# Altium project TVC_FC.PrjPcb
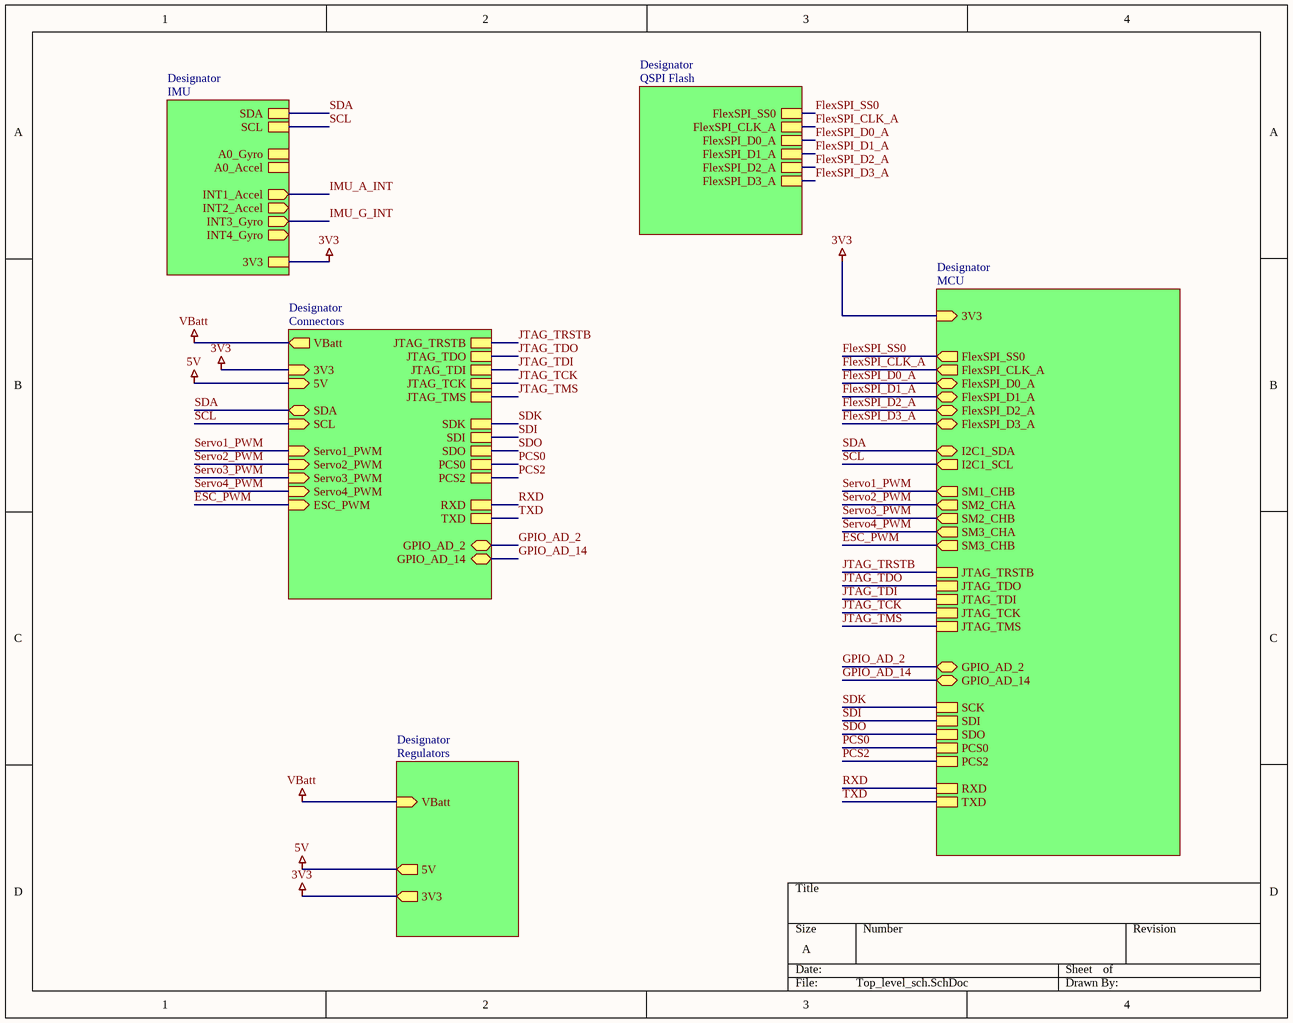
[diagram p0: Top_level_sch.SchDoc]
6 sheets, 92 parts. Net scope: hierarchical (ports join the sheet entries above them; power ports are global).
Board file: FC_PCB.PcbDoc
Sheets:
  Top_level_sch.SchDoc
    Designator = MCU.SchDoc
    Designator = IMU.SchDoc
    Designator = Connectors.SchDoc
    Designator = Regulators.SchDoc
    Designator = QSPI Flash.SchDoc

## Sheet Top_level_sch.SchDoc
size A; SheetNumber: 1; SheetTotal: 6

### Sub-sheets
Designator = MCU: I2C1_SCL (out), I2C1_SDA (bidir), JTAG_TRSTB, JTAG_TDO, JTAG_TDI, JTAG_TCK, JTAG_TMS, 3V3 (in), SM2_CHA (out), SM2_CHB (out), SM1_CHB (out), SM3_CHB (out), SM3_CHA (out), GPIO_AD_2 (bidir), GPIO_AD_14 (bidir), SCK, SDI, SDO, PCS0, PCS2, RXD, TXD, FlexSPI_SS0 (out), FlexSPI_D1_A (bidir), FlexSPI_D2_A (bidir), FlexSPI_D0_A (bidir), FlexSPI_CLK_A (out), FlexSPI_D3_A (bidir)
Designator = IMU: SCL, INT1_Accel (out), INT3_Gyro (out), SDA, INT4_Gyro (out), INT2_Accel (out), A0_Accel, A0_Gyro, 3V3
Designator = Connectors: SDA (bidir), SCL (in), 5V (in), 3V3 (in), Servo1_PWM (in), ESC_PWM (in), VBatt (out), Servo2_PWM (in), Servo3_PWM (in), Servo4_PWM (in), JTAG_TRSTB, JTAG_TDO, JTAG_TDI, JTAG_TCK, JTAG_TMS, SDK, SDI, SDO, PCS0, PCS2, RXD, TXD, GPIO_AD_2 (bidir), GPIO_AD_14 (bidir)
Designator = Regulators: VBatt (in), 5V (out), 3V3 (out)
Designator = QSPI Flash: FlexSPI_D0_A, FlexSPI_CLK_A, FlexSPI_SS0, FlexSPI_D2_A, FlexSPI_D3_A, FlexSPI_D1_A

### Nets
3V3: sheet Designator/3V3, sheet Designator/3V3, sheet Designator/3V3, sheet Designator/3V3
5V: sheet Designator/5V, sheet Designator/5V
VBatt: sheet Designator/VBatt, sheet Designator/VBatt  [project net FB]
ESC_PWM: sheet Designator/SM3_CHB, sheet Designator/ESC_PWM
FlexSPI_CLK_A: sheet Designator/FlexSPI_CLK_A, sheet Designator/FlexSPI_CLK_A
FlexSPI_D0_A: sheet Designator/FlexSPI_D0_A, sheet Designator/FlexSPI_D0_A
FlexSPI_D1_A: sheet Designator/FlexSPI_D1_A, sheet Designator/FlexSPI_D1_A
FlexSPI_D2_A: sheet Designator/FlexSPI_D2_A, sheet Designator/FlexSPI_D2_A
FlexSPI_D3_A: sheet Designator/FlexSPI_D3_A, sheet Designator/FlexSPI_D3_A
FlexSPI_SS0: sheet Designator/FlexSPI_SS0, sheet Designator/FlexSPI_SS0
GPIO_AD_2: sheet Designator/GPIO_AD_2, sheet Designator/GPIO_AD_2
GPIO_AD_14: sheet Designator/GPIO_AD_14, sheet Designator/GPIO_AD_14
JTAG_TCK: sheet Designator/JTAG_TCK, sheet Designator/JTAG_TCK
JTAG_TDI: sheet Designator/JTAG_TDI, sheet Designator/JTAG_TDI
JTAG_TDO: sheet Designator/JTAG_TDO, sheet Designator/JTAG_TDO
JTAG_TMS: sheet Designator/JTAG_TMS, sheet Designator/JTAG_TMS
JTAG_TRSTB: sheet Designator/JTAG_TRSTB, sheet Designator/JTAG_TRSTB
PCS0: sheet Designator/PCS0, sheet Designator/PCS0
PCS2: sheet Designator/PCS2, sheet Designator/PCS2
RXD: sheet Designator/RXD, sheet Designator/RXD
SCL: sheet Designator/I2C1_SCL, sheet Designator/SCL, sheet Designator/SCL
SDA: sheet Designator/I2C1_SDA, sheet Designator/SDA, sheet Designator/SDA
SDI: sheet Designator/SDI, sheet Designator/SDI
SDK: sheet Designator/SCK, sheet Designator/SDK
SDO: sheet Designator/SDO, sheet Designator/SDO
Servo1_PWM: sheet Designator/SM1_CHB, sheet Designator/Servo1_PWM
Servo2_PWM: sheet Designator/SM2_CHA, sheet Designator/Servo2_PWM
Servo3_PWM: sheet Designator/SM2_CHB, sheet Designator/Servo3_PWM
Servo4_PWM: sheet Designator/SM3_CHA, sheet Designator/Servo4_PWM
TXD: sheet Designator/TXD, sheet Designator/TXD

## Sheet MCU.SchDoc
size C; SheetNumber: 2; SheetTotal: 6
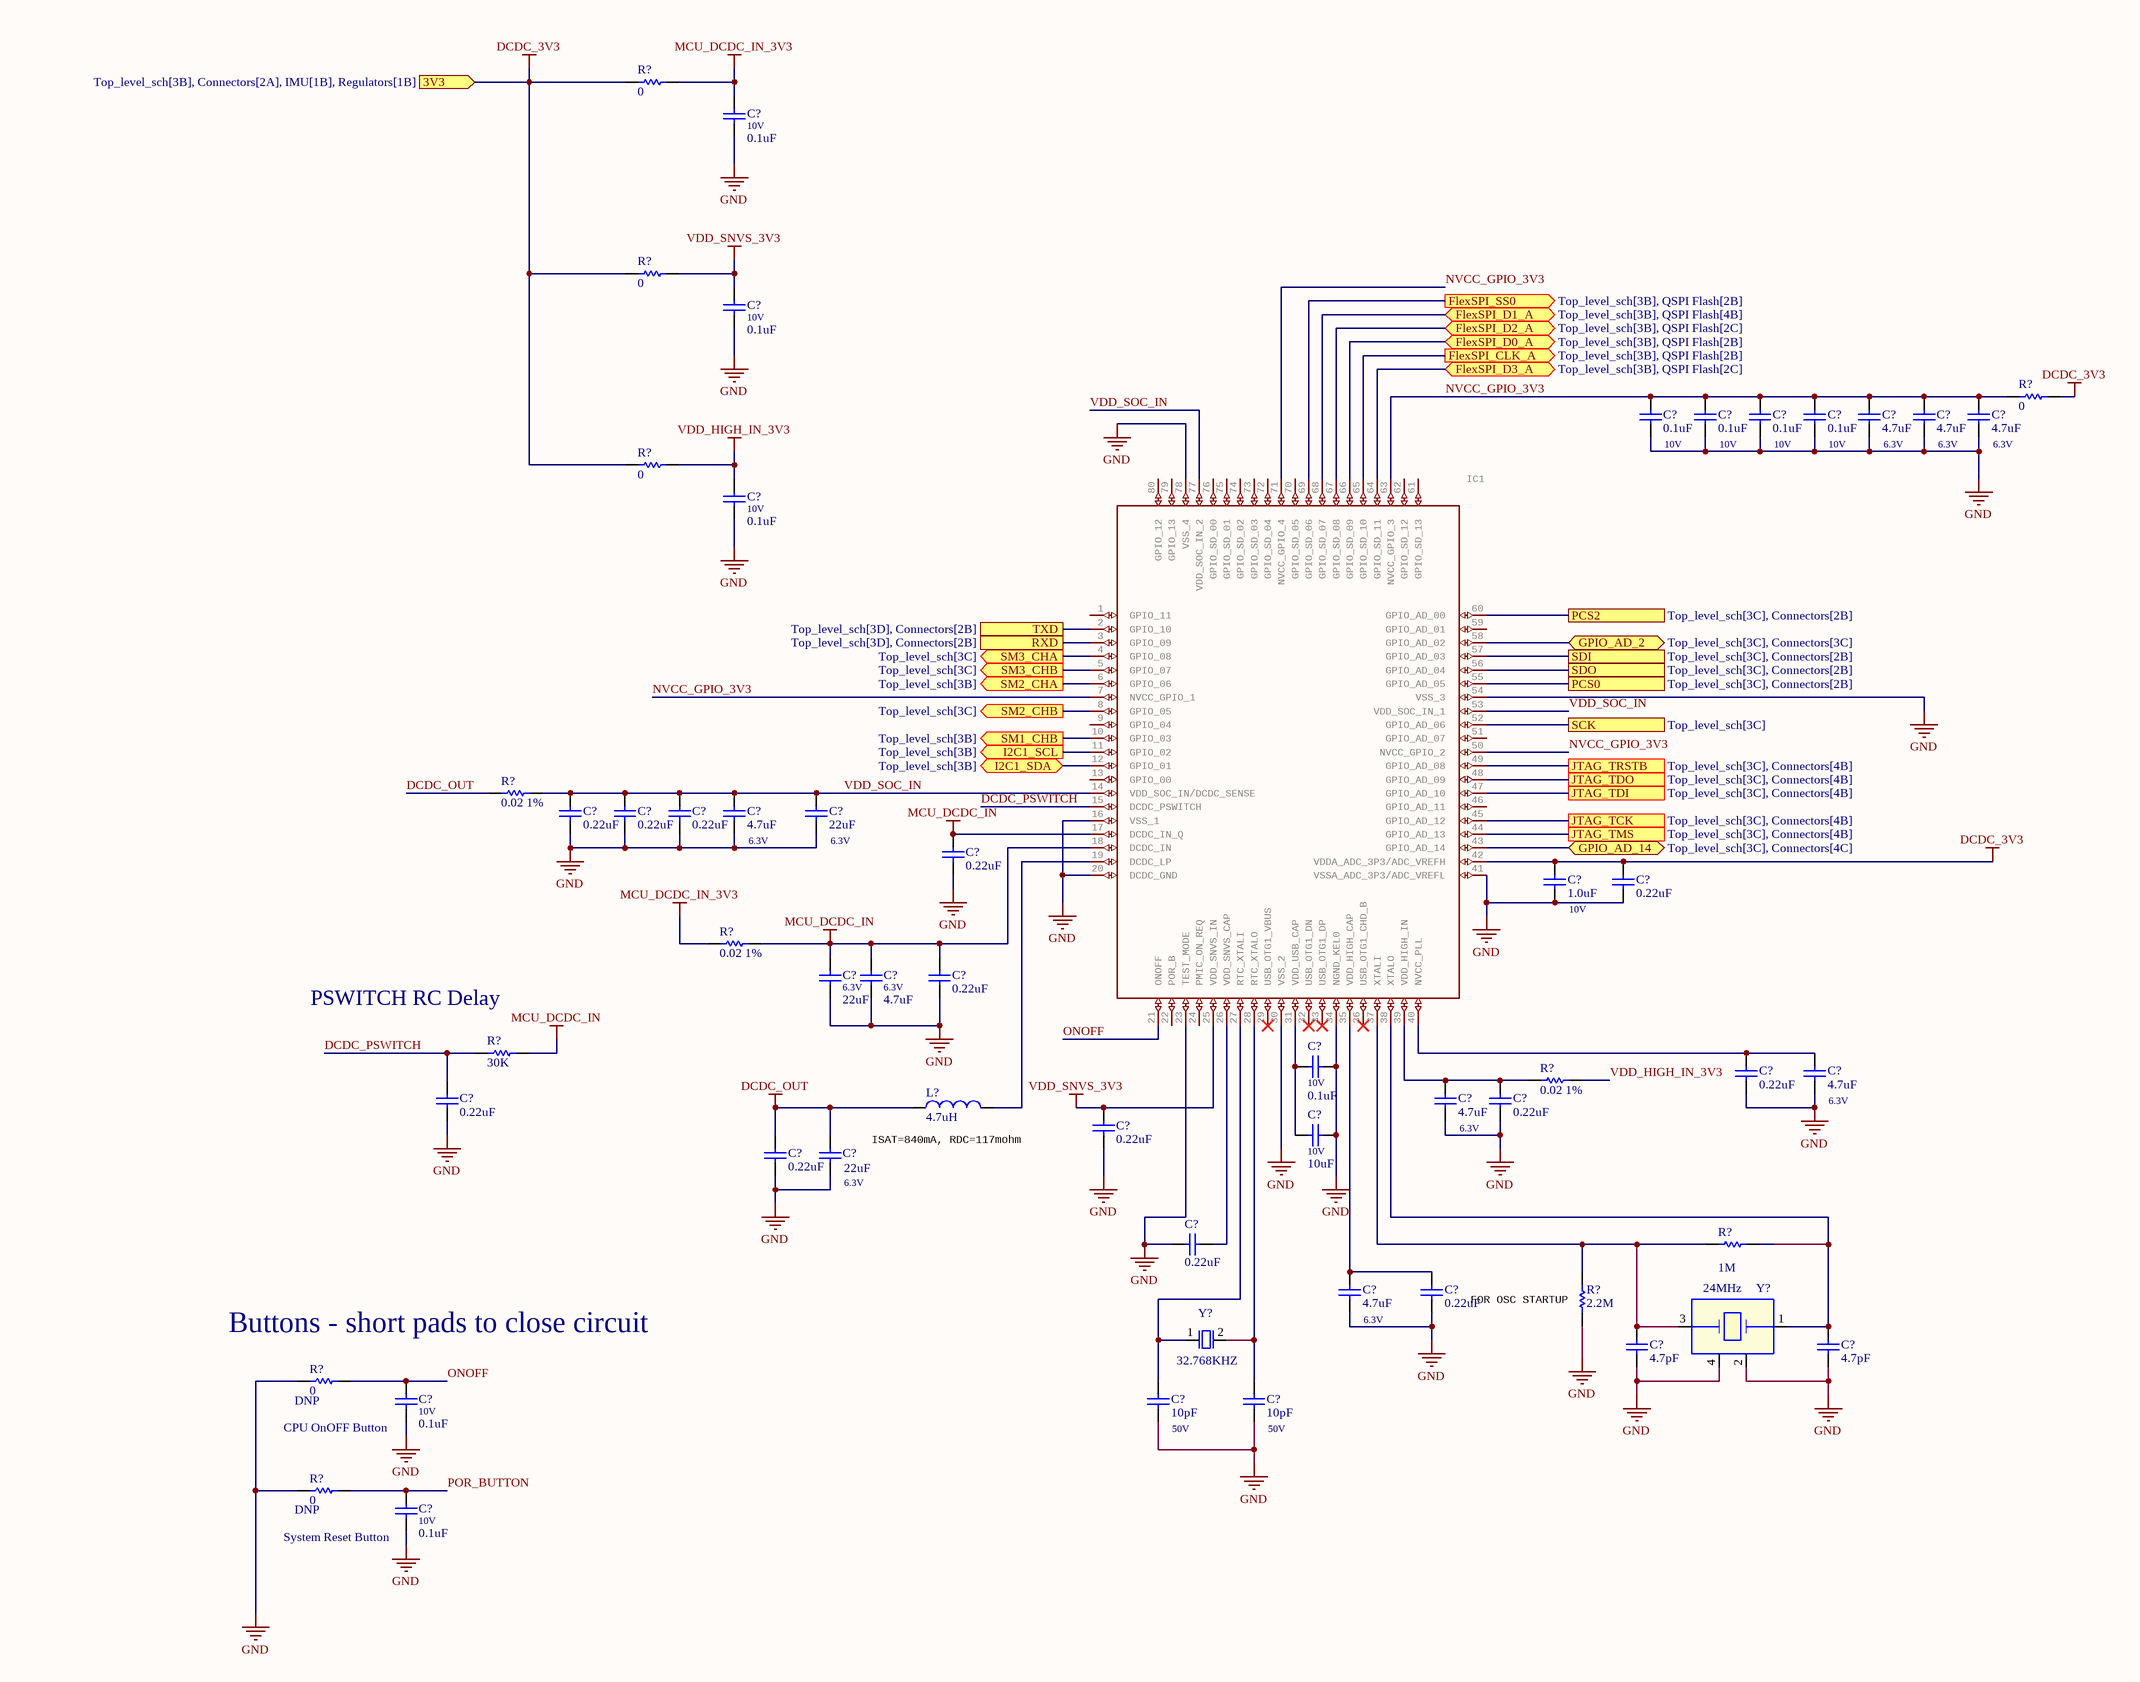
[diagram p1: MCU.SchDoc]

### Parts
(Parts that share a designator on the sheet are numbered #1, #2 ... from top to bottom, then left to right.)
C?#1  value 0.1uF  Voltage: 10V  (hidden comment: Capacitor)
C?#2  value 0.1uF  Voltage: 10V  (hidden comment: Capacitor)
C?#3  value 0.1uF  Voltage: 10V  (hidden comment: Capacitor)
C?#4  value 0.1uF  Voltage: 10V  (hidden comment: Capacitor)
C?#5  value 0.1uF  Voltage: 10V  (hidden comment: Capacitor)
C?#6  value 0.1uF  Voltage: 10V  (hidden comment: Capacitor)
C?#7  value 4.7uF  Voltage: 6.3V  (hidden comment: Capacitor)
C?#8  value 4.7uF  Voltage: 6.3V  (hidden comment: Capacitor)
C?#9  value 4.7uF  Voltage: 6.3V  (hidden comment: Capacitor)
C?#10  value 0.1uF  Voltage: 10V  (hidden comment: Capacitor)
C?#11  OC14: 0.22uF  (hidden comment: Capacitor)
C?#12  OC15: 0.22uF  (hidden comment: Capacitor)
C?#13  OC16: 0.22uF  (hidden comment: Capacitor)
C?#14  value 4.7uF  Voltage: 6.3V  (hidden comment: Capacitor)
C?#15  value 22uF  Voltage: 6.3V  (hidden comment: Capacitor)
C?#16  value 0.22uF  (hidden comment: Capacitor)
C?#17  value 1.0uF  Voltage: 10V  (hidden comment: Capacitor)
C?#18  OC7: 0.22uF  (hidden comment: Capacitor)
C?#19  value 22uF  Voltage: 6.3V  (hidden comment: Capacitor)
C?#20  value 4.7uF  Voltage: 6.3V  (hidden comment: Capacitor)
C?#21  value 0.22uF  (hidden comment: Capacitor)
C?#22  value 0.1uF  Voltage: 10V  (hidden comment: Capacitor)
C?#23  OC25: 0.22uF  (hidden comment: Capacitor)
C?#24  value 4.7uF  Voltage: 6.3V  (hidden comment: Capacitor)
C?#25  value 0.22uF  (hidden comment: Capacitor)
C?#26  value 4.7uF  Voltage: 6.3V  (hidden comment: Capacitor)
C?#27  OC20: 0.22uF  (hidden comment: Capacitor)
C?#28  value 10uF  Voltage: 10V  (hidden comment: Capacitor)
C?#29  value 0.22uF  (hidden comment: Capacitor)
C?#30  value 0.22uF  (hidden comment: Capacitor)
C?#31  value 22uF  Voltage: 6.3V  (hidden comment: Capacitor)
C?#32  OC24: 0.22uF  (hidden comment: Capacitor)
C?#33  value 4.7uF  Voltage: 6.3V  (hidden comment: Capacitor)
C?#34  OC22: 0.22uF  (hidden comment: Capacitor)
C?#35  OC16: 4.7pF  (hidden comment: Capacitor)
C?#36  OC16: 4.7pF  (hidden comment: Capacitor)
C?#37  value 0.1uF  Voltage: 10V  (hidden comment: Capacitor)
C?#38  value 10pF  Voltage: 50V  (hidden comment: Capacitor)
C?#39  value 10pF  Voltage: 50V  (hidden comment: Capacitor)
C?#40  value 0.1uF  Voltage: 10V  (hidden comment: Capacitor)
IC1  ARM Microcontrollers - MCU i.MX RT1010 Crossover MCU with Arm  Cortex -M7 core   Source:  Datasheet  [QFP50P1400X1400X160-80N]  (value not drawn)
L?#1  value 4.7uH  (hidden comment: Inductor)
R?#1  value 0  (hidden comment: Resistor)
R?#2  value 0  (hidden comment: Resistor)
R?#3  OR12: 0  (hidden comment: Resistor)
R?#4  value 0  (hidden comment: Resistor)
R?#5  OR13: 0.02 1%  (hidden comment: Resistor)
R?#6  value 0.02 1%  (hidden comment: Resistor)
R?#7  value 30K  (hidden comment: Resistor)
R?#8  OR14: 0.02 1%  (hidden comment: Resistor)
R?#9  value 1M  (hidden comment: Resistor)
R?#10  OR13: 2.2M  (hidden comment: Resistor)
R?#11  value 0  (hidden comment: Resistor)
R?#12  value 0  (hidden comment: Resistor)
Y?#1  24MHz  [xtl4_2p1x1p7mm_sm]
Y?#2  32.768KHZ  [XTAL2-3p2x1p5-SM]

### Ports
3V3 (in, see Top_level_sch[3B], Connectors[2A], IMU[1B], Regulators[1B]), FlexSPI_CLK_A (out, see Top_level_sch[3B], QSPI Flash[2B]), FlexSPI_D0_A (bidir, see Top_level_sch[3B], QSPI Flash[2B]), FlexSPI_D1_A (bidir, see Top_level_sch[3B], QSPI Flash[4B]), FlexSPI_D2_A (bidir, see Top_level_sch[3B], QSPI Flash[2C]), FlexSPI_D3_A (bidir, see Top_level_sch[3B], QSPI Flash[2C]), FlexSPI_SS0 (out, see Top_level_sch[3B], QSPI Flash[2B]), GPIO_AD_2 (bidir, see Top_level_sch[3C], Connectors[3C]), GPIO_AD_14 (bidir, see Top_level_sch[3C], Connectors[4C]), I2C1_SCL (out, see Top_level_sch[3B]), I2C1_SDA (bidir, see Top_level_sch[3B]), JTAG_TCK (see Top_level_sch[3C], Connectors[4B]), JTAG_TDI (see Top_level_sch[3C], Connectors[4B]), JTAG_TDO (see Top_level_sch[3C], Connectors[4B]), JTAG_TMS (see Top_level_sch[3C], Connectors[4B]), JTAG_TRSTB (see Top_level_sch[3C], Connectors[4B]), PCS0 (see Top_level_sch[3C], Connectors[2B]), PCS2 (see Top_level_sch[3C], Connectors[2B]), RXD (see Top_level_sch[3D], Connectors[2B]), SCK (see Top_level_sch[3C]), SDI (see Top_level_sch[3C], Connectors[2B]), SDO (see Top_level_sch[3C], Connectors[2B]), SM1_CHB (out, see Top_level_sch[3B]), SM2_CHA (out, see Top_level_sch[3B]), SM2_CHB (out, see Top_level_sch[3C]), SM3_CHA (out, see Top_level_sch[3C]), SM3_CHB (out, see Top_level_sch[3C]), TXD (see Top_level_sch[3D], Connectors[2B])

### Nets
DCDC_3V3: C?#17.2 C?#18.2 IC1.42(VDDA_ADC_3P3/ADC_VREFH) R?#1.1 R?#2.1 R?#3.2 R?#4.1 ; port 3V3  [project net 3V3]
DCDC_OUT: C?#30.2 C?#31.2 L?#1.1 R?#5.1
GND: C?#1.2 C?#2.2 C?#3.1 C?#4.1 C?#5.1 C?#6.1 C?#7.1 C?#8.1 C?#9.1 C?#10.2 C?#11.1 C?#12.1 C?#13.1 C?#14.1 C?#15.1 C?#16.1 C?#17.1 C?#18.1 C?#19.1 C?#20.1 C?#21.1 C?#22.1 C?#23.1 C?#24.1 C?#25.1 C?#26.1 C?#27.1 C?#28.1 C?#29.1 C?#30.1 C?#31.1 C?#32.2 C?#33.1 C?#34.1 C?#35.1 C?#36.1 C?#37.2 C?#38.1 C?#39.1 C?#40.2 IC1.16(VSS_1) IC1.20(DCDC_GND) IC1.23(TEST_MODE) IC1.30(VSS_2) IC1.34(NGND_KEL0) IC1.41(VSSA_ADC_3P3/ADC_VREFL) IC1.54(VSS_3) IC1.78(VSS_4) R?#10.1 R?#11.1 R?#12.1 Y?#1.2 Y?#1.4  [project net FB]
MCU_DCDC_IN: C?#16.2 C?#19.2 C?#20.2 C?#21.2 IC1.17(DCDC_IN_Q) IC1.18(DCDC_IN) R?#6.1 R?#7.1
MCU_DCDC_IN_3V3: C?#1.1 R?#1.2 R?#6.2
VDD_HIGH_IN_3V3: C?#10.1 R?#4.2 R?#8.2
VDD_SNVS_3V3: C?#2.1 C?#29.2 IC1.25(VDD_SNVS_IN) R?#2.2
DCDC_PSWITCH: C?#25.2 IC1.15(DCDC_PSWITCH) R?#7.2
ESC_PWM: IC1.5(GPIO_07) ; port SM3_CHB
FlexSPI_CLK_A: IC1.65(GPIO_SD_10) ; port FlexSPI_CLK_A
FlexSPI_D0_A: IC1.66(GPIO_SD_09) ; port FlexSPI_D0_A
FlexSPI_D1_A: IC1.68(GPIO_SD_07) ; port FlexSPI_D1_A
FlexSPI_D2_A: IC1.67(GPIO_SD_08) ; port FlexSPI_D2_A
FlexSPI_D3_A: IC1.64(GPIO_SD_11) ; port FlexSPI_D3_A
FlexSPI_SS0: IC1.69(GPIO_SD_06) ; port FlexSPI_SS0
GPIO_AD_2: IC1.58(GPIO_AD_02) ; port GPIO_AD_2
GPIO_AD_14: IC1.43(GPIO_AD_14) ; port GPIO_AD_14
JTAG_TCK: IC1.45(GPIO_AD_12) ; port JTAG_TCK
JTAG_TDI: IC1.47(GPIO_AD_10) ; port JTAG_TDI
JTAG_TDO: IC1.48(GPIO_AD_09) ; port JTAG_TDO
JTAG_TMS: IC1.44(GPIO_AD_13) ; port JTAG_TMS
JTAG_TRSTB: IC1.49(GPIO_AD_08) ; port JTAG_TRSTB
NVCC_GPIO_3V3: C?#3.2 C?#4.2 C?#5.2 C?#6.2 C?#7.2 C?#8.2 C?#9.2 IC1.7(NVCC_GPIO_1) IC1.50(NVCC_GPIO_2) IC1.63(NVCC_GPIO_3) IC1.71(NVCC_GPIO_4) R?#3.1
ONOFF: C?#37.1 IC1.21(ONOFF) R?#11.2
PCS0: IC1.55(GPIO_AD_05) ; port PCS0
PCS2: IC1.60(GPIO_AD_00) ; port PCS2
POR_BUTTON: C?#40.1 R?#12.2
RXD: IC1.3(GPIO_09) ; port RXD
SCL: IC1.11(GPIO_02) ; port I2C1_SCL
SDA: IC1.12(GPIO_01) ; port I2C1_SDA
SDI: IC1.57(GPIO_AD_03) ; port SDI
SDK: IC1.52(GPIO_AD_06) ; port SCK
SDO: IC1.56(GPIO_AD_04) ; port SDO
Servo1_PWM: IC1.10(GPIO_03) ; port SM1_CHB
Servo2_PWM: IC1.6(GPIO_06) ; port SM2_CHA
Servo3_PWM: IC1.8(GPIO_05) ; port SM2_CHB
Servo4_PWM: IC1.4(GPIO_08) ; port SM3_CHA
TXD: IC1.2(GPIO_10) ; port TXD
VDD_SOC_IN: C?#11.2 C?#12.2 C?#13.2 C?#14.2 C?#15.2 IC1.14(VDD_SOC_IN/DCDC_SENSE) IC1.53(VDD_SOC_IN_1) IC1.77(VDD_SOC_IN_2) R?#5.2
NetC?#22_2: C?#22.2 C?#28.2 IC1.31(VDD_USB_CAP)
NetC?#23_2: C?#23.2 C?#24.2 IC1.40(NVCC_PLL)
NetC?#26_2: C?#26.2 C?#27.2 IC1.39(VDD_HIGH_IN) R?#8.1
NetC?#32_1: C?#32.1 IC1.26(VDD_SNVS_CAP)
NetC?#33_2: C?#33.2 C?#34.2 IC1.35(VDD_HIGH_CAP)
NetC?#35_2: C?#35.2 IC1.37(XTALI) R?#9.1 R?#10.2 Y?#1.3
NetC?#36_2: C?#36.2 IC1.38(XTALO) R?#9.2 Y?#1.1
NetC?#38_2: C?#38.2 IC1.27(RTC_XTALI) Y?#2.1
NetC?#39_2: C?#39.2 IC1.28(RTC_XTALO) Y?#2.2
NetIC1_19: IC1.19(DCDC_LP) L?#1.2

Not connected (* = marked no-connect by the designer): IC1 1(GPIO_11) 9(GPIO_04) 13(GPIO_00) 22(POR_B) 24(PMIC_ON_REQ) 29(USB_OTG1_VBUS)* 32(USB_OTG1_DN)* 33(USB_OTG1_DP)* 36(USB_OTG1_CHD_B)* 46(GPIO_AD_11) 51(GPIO_AD_07) 59(GPIO_AD_01) 61(GPIO_SD_13) 62(GPIO_SD_12) 70(GPIO_SD_05) 72(GPIO_SD_04) 73(GPIO_SD_03) 74(GPIO_SD_02) 75(GPIO_SD_01) 76(GPIO_SD_00) 79(GPIO_13) 80(GPIO_12)

### Notes on the sheet
- (near R?#7) PSWITCH RC Delay
- ISAT=840mA, RDC=117mohm
- Buttons - short pads to close circuit
- FOR OSC STARTUP
- CPU OnOFF Button
- (near C?#40) System Reset Button

### Library data of the parts
C?#1-C?#40 = Capacitor: SimulationGenericComponent: True
IC1 = MIMXRT1011DAE5A: Manufacturer_Name: NXP; GateName_1: G$1; SymbolName_1: MIMXRT1011DAE5A; LibraryName: MIMXRT1011DAE5A; DeviceSetName: MIMXRT1011DAE5A; Package: QFP50P1400X1400X160-80N; Manufacturer_Part_Number: MIMXRT1011DAE5A; Mouser_Part_Number: 771-MIMXRT1011DAE5A; Mouser_Price-Stock: https://www.mouser.co.uk/ProductDetail/NXP-Semiconductors/MIMXRT1011DAE5A?qs=P1JMDcb91o5GoeF%252BJrcvqQ%3D%3D; Arrow_Part_Number: MIMXRT1011DAE5A; Arrow_Price-Stock: https://www.arrow.com/en/products/mimxrt1011dae5a/nxp-semiconductors; Height: 1.6mm
L?#1 = Inductor: SimulationGenericComponent: True
R?#1-R?#4 R?#11 R?#12 = Resistor: SimulationGenericComponent: True; TC1: 0; TC2: 0
R?#5-R?#10 = Resistor: TC1: 0; SimulationGenericComponent: True; TC2: 0
Y?#1 = XTAL_13: XTAL 24MHZ -- 20PPM 2.0X1.6MM SMD; CLASS: IC; CAD_APPROVED: Yes; Temp_Range: -30C to 85C; MFG_PN01: XRCGB24M000F2P29R0; MFG_NAME01: MURATA; AGILE_PN: 230-78216; PCB Footprint: xtl4_2p1x1p7mm_sm; HEIGHT: 0.7MM; ROHS: Yes
Y?#2 = CRYSTAL: XTAL 32.768KHZ 7PF 20PPM -- SMT; CLASS: IC; AGILE_PN: 230-78102; MFG_NAME01: EPSON ELECTRONICS; MFG_PN01: FC-135 32.7680KA-AG3; CAD_APPROVED: Yes; PCB Footprint: XTAL2-3p2x1p5-SM; ROHS: Yes; HEIGHT: 0.9MM

## Sheet IMU.SchDoc
size A; SheetNumber: 3; SheetTotal: 6
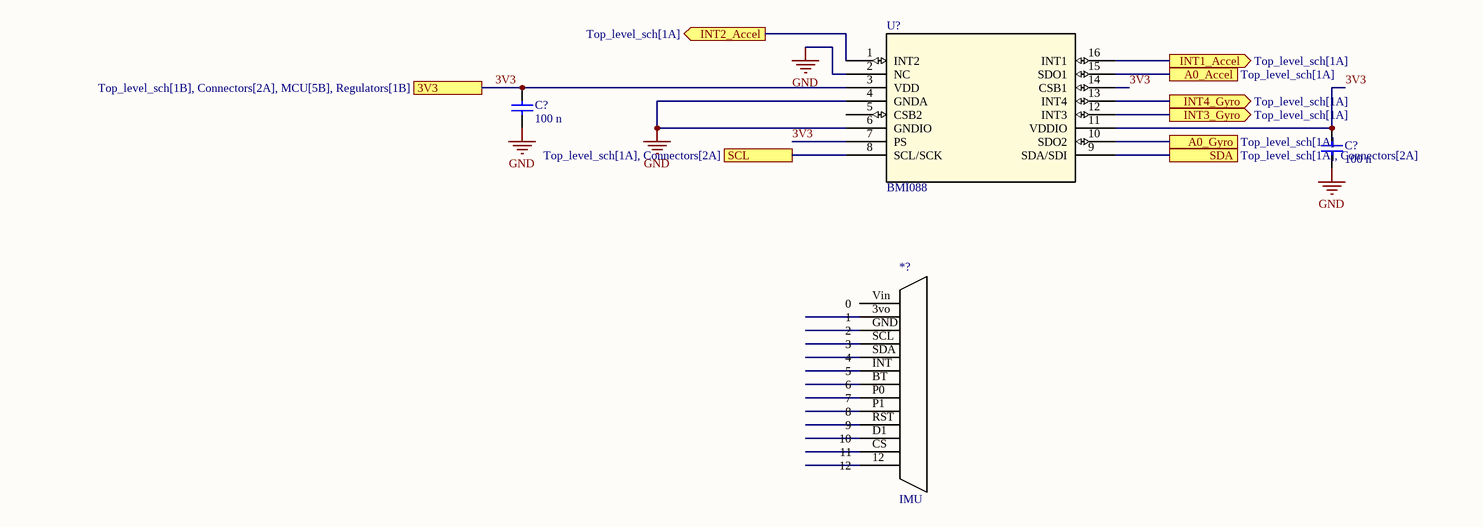
[diagram p2: IMU.SchDoc]

### Parts
(Parts that share a designator on the sheet are numbered #1, #2 ... from top to bottom, then left to right.)
*?  IMU
C?#41  value 100 n  (hidden comment: Capacitor)
C?#42  value 100 n  (hidden comment: Capacitor)
U?#1  BMI088  [QFN_BMI085_BOS]

### Ports
3V3 (see Top_level_sch[1B], Connectors[2A], MCU[5B], Regulators[1B]), A0_Accel (see Top_level_sch[1A]), A0_Gyro (see Top_level_sch[1A]), INT1_Accel (out, see Top_level_sch[1A]), INT2_Accel (out, see Top_level_sch[1A]), INT3_Gyro (out, see Top_level_sch[1A]), INT4_Gyro (out, see Top_level_sch[1A]), SCL (see Top_level_sch[1A], Connectors[2A]), SDA (see Top_level_sch[1A], Connectors[2A])

### Nets
3V3: C?#41.1 C?#42.1 U?#1.3(VDD) U?#1.7(PS) U?#1.11(VDDIO) U?#1.14(CSB1) ; port 3V3
GND: C?#41.2 C?#42.2 U?#1.2(NC) U?#1.4(GNDA) U?#1.6(GNDIO)  [project net FB]
IMU_A_INT: U?#1.16(INT1) ; port INT1_Accel
IMU_G_INT: U?#1.12(INT3) ; port INT3_Gyro
SCL: U?#1.8(SCL/SCK) ; port SCL
SDA: U?#1.9(SDA/SDI) ; port SDA
NetU?#1_1: U?#1.1(INT2) ; port INT2_Accel
NetU?#1_10: U?#1.10(SDO2) ; port A0_Gyro
NetU?#1_13: U?#1.13(INT4) ; port INT4_Gyro
NetU?#1_15: U?#1.15(SDO1) ; port A0_Accel

Not connected (* = marked no-connect by the designer): *? 3vo(1) 12 BT(6) CS(11) D1(10) GND(2) INT(5) P0(7) P1(8) RST(9) SCL(3) SDA(4) Vin(0); U?#1 5(CSB2)

### Library data of the parts
C?#41 C?#42 = Capacitor: SimulationGenericComponent: True
U?#1 = BMI088: No Description Available; Mfr_Name: Bosch Sensortec; Copyright: Copyright (C) 2022 Ultra Librarian. All rights reserved.; Manufacturer_Part_Number: BMI088; RefDes: RefDes; Type: DEV

## Sheet Connectors.SchDoc
size A; SheetNumber: 4; SheetTotal: 6
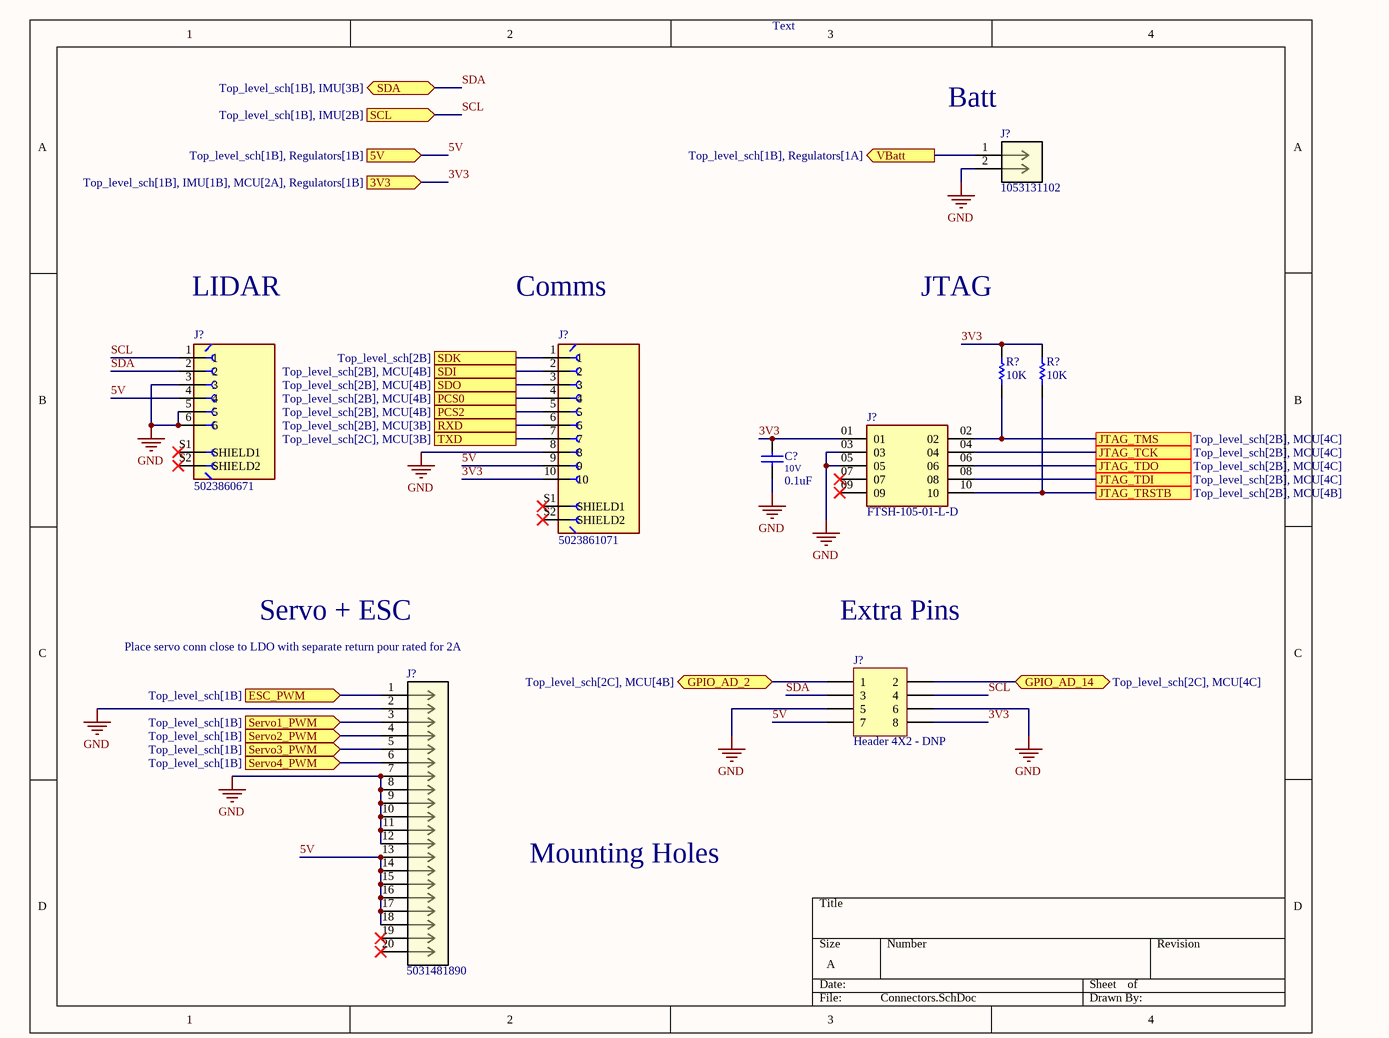
[diagram p3: Connectors.SchDoc]

### Parts
(Parts that share a designator on the sheet are numbered #1, #2 ... from top to bottom, then left to right.)
C?#43  value 0.1uF  Voltage: 10V  (hidden comment: Capacitor)
J?#1  1053131102  [CON_1053131102]
J?#2  5023860671  [MOLEX_5023860671]
J?#3  5023861071  [MOLEX_5023861071]
J?#4  FTSH-105-01-L-D  [SAMTEC_FTSH-105-01-L-D]
J?#5  Header 4X2 - DNP  [HDR2X4]
J?#6  5031481890  [CON_5031481890_MOL]
R?#13  value 10K  (hidden comment: Resistor)
R?#14  value 10K  (hidden comment: Resistor)

### Ports
3V3 (in, see Top_level_sch[1B], IMU[1B], MCU[2A], Regulators[1B]), 5V (in, see Top_level_sch[1B], Regulators[1B]), ESC_PWM (in, see Top_level_sch[1B]), GPIO_AD_2 (bidir, see Top_level_sch[2C], MCU[4B]), GPIO_AD_14 (bidir, see Top_level_sch[2C], MCU[4C]), JTAG_TCK (see Top_level_sch[2B], MCU[4C]), JTAG_TDI (see Top_level_sch[2B], MCU[4C]), JTAG_TDO (see Top_level_sch[2B], MCU[4C]), JTAG_TMS (see Top_level_sch[2B], MCU[4C]), JTAG_TRSTB (see Top_level_sch[2B], MCU[4B]), PCS0 (see Top_level_sch[2B], MCU[4B]), PCS2 (see Top_level_sch[2B], MCU[4B]), RXD (see Top_level_sch[2B], MCU[3B]), SCL (in, see Top_level_sch[1B], IMU[2B]), SDA (bidir, see Top_level_sch[1B], IMU[3B]), SDI (see Top_level_sch[2B], MCU[4B]), SDK (see Top_level_sch[2B]), SDO (see Top_level_sch[2B], MCU[4B]), Servo1_PWM (in, see Top_level_sch[1B]), Servo2_PWM (in, see Top_level_sch[1B]), Servo3_PWM (in, see Top_level_sch[1B]), Servo4_PWM (in, see Top_level_sch[1B]), TXD (see Top_level_sch[2C], MCU[3B]), VBatt (out, see Top_level_sch[1B], Regulators[1A])

### Nets
3V3: C?#43.2 J?#3.10 J?#4.01 J?#5.8 R?#13.2 R?#14.2 ; port 3V3
5V: J?#2.4 J?#3.9 J?#5.7 J?#6.13 J?#6.14 J?#6.15 J?#6.16 J?#6.17 J?#6.18 ; port 5V
GND: C?#43.1 J?#1.1 J?#1.2 J?#2.3 J?#2.5 J?#2.6 J?#3.8 J?#4.03 J?#4.05 J?#5.5 J?#5.6 J?#6.2 J?#6.7 J?#6.8 J?#6.9 J?#6.10 J?#6.11 J?#6.12 ; port VBatt  [project net FB]
ESC_PWM: J?#6.1 ; port ESC_PWM
GPIO_AD_2: J?#5.1 ; port GPIO_AD_2
GPIO_AD_14: J?#5.2 ; port GPIO_AD_14
JTAG_TCK: J?#4.04 ; port JTAG_TCK
JTAG_TDI: J?#4.08 ; port JTAG_TDI
JTAG_TDO: J?#4.06 ; port JTAG_TDO
JTAG_TMS: J?#4.02 R?#13.1 ; port JTAG_TMS
JTAG_TRSTB: J?#4.10 R?#14.1 ; port JTAG_TRSTB
PCS0: J?#3.4 ; port PCS0
PCS2: J?#3.5 ; port PCS2
RXD: J?#3.6 ; port RXD
SCL: J?#2.1 J?#5.4 ; port SCL
SDA: J?#2.2 J?#5.3 ; port SDA
SDI: J?#3.2 ; port SDI
SDK: J?#3.1 ; port SDK
SDO: J?#3.3 ; port SDO
Servo1_PWM: J?#6.3 ; port Servo1_PWM
Servo2_PWM: J?#6.4 ; port Servo2_PWM
Servo3_PWM: J?#6.5 ; port Servo3_PWM
Servo4_PWM: J?#6.6 ; port Servo4_PWM
TXD: J?#3.7 ; port TXD

Not connected (* = marked no-connect by the designer): J?#2 S1(SHIELD1)* S2(SHIELD2)*; J?#3 S1(SHIELD1)* S2(SHIELD2)*; J?#4 07* 09*; J?#6 19* 20*

### Notes on the sheet
- Text
- (near J?#1) Batt
- LIDAR
- Comms
- JTAG
- (near J?#6) Place servo conn close to LDO with separate return pour rated for 2A
- Servo + ESC
- Extra Pins
- Mounting Holes

### Library data of the parts
C?#43 = Capacitor: SimulationGenericComponent: True
J?#1 = 1053131102: No Description Available; Mfr_Name: Molex Connector Corporation; Copyright: Copyright (C) 2022 Ultra Librarian. All rights reserved.; Manufacturer_Part_Number: 1053131102; RefDes: RefDes; Type: DEV
J?#2 = 5023860671: 1.25mm Pitch CLIK-Mate Wire-to-Board PCB Receptacle, Single Row, Right-Angle, Gold (Au) Plating, 6 Circuits; MF: Molex; Availability: In Stock; Check_prices: https://www.snapeda.com/parts/5023860671/Molex/view-part/?ref=eda; Value: *; Package: None; MP: 5023860671; Price: None; SnapEDA_Link: https://www.snapeda.com/parts/5023860671/Molex/view-part/?ref=snap; Purchase-URL: https://pricing.snapeda.com/search/part/5023860671/?ref=eda
J?#3 = 5023861071: 1.25mm Pitch CLIK-Mate Wire-to-Board PCB Receptacle, Single Row, Right-Angle, Tin (Sn) Plating; Value: *; Package: None; MP: 5023861071; Price: None; Availability: Unavailable
J?#4 = FTSH-105-01-L-D: Connector Header Surface Mount 10 position 0.050 (1.27mm); MF: Samtec; Package: Connector Header Samtec; Purchase-URL: https://pricing.snapeda.com/search/part/FTSH-105-01-L-D/?ref=eda; Value: *; MP: FTSH-105-01-L-D; Availability: Good; Price: None
J?#5 = Header 4X2: Header, 4-Pin, Dual row; LatestRevisionDate: 17-Jul-2002; LatestRevisionNote: Re-released for DXP Platform.; Publisher: Altium Limited
J?#6 = 5031481890: No Description Available; Mfr_Name: Molex Connector Corporation; Copyright: Copyright (C) 2022 Ultra Librarian. All rights reserved.; Manufacturer_Part_Number: 5031481890; RefDes: RefDes; Type: DEV
R?#13 R?#14 = Resistor: TC1: 0; SimulationGenericComponent: True; TC2: 0

## Sheet Regulators.SchDoc
size A; SheetNumber: 5; SheetTotal: 6
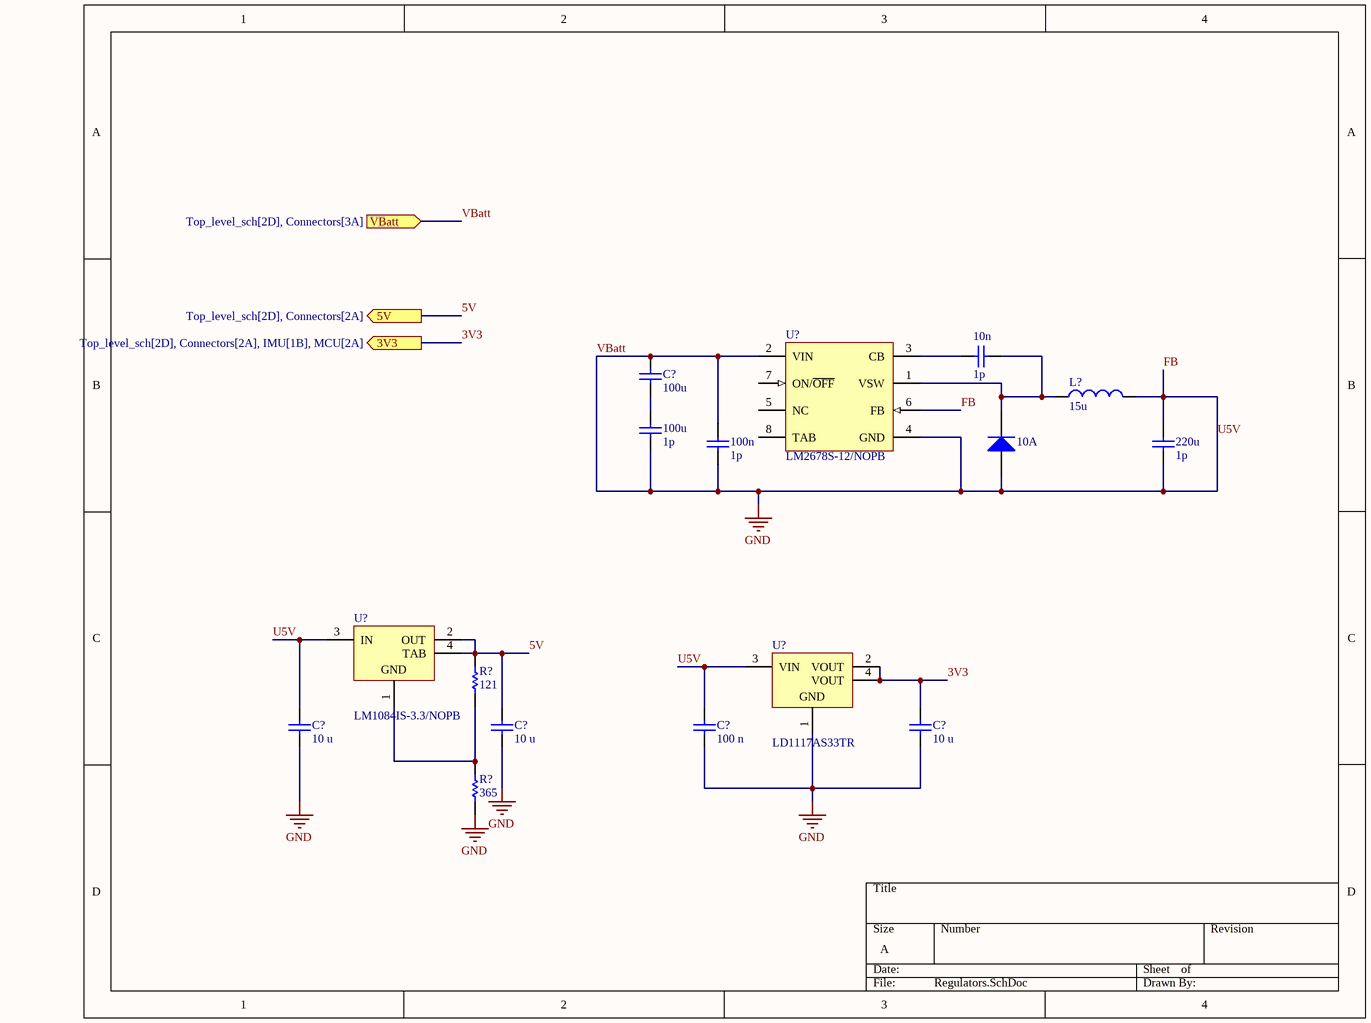
[diagram p4: Regulators.SchDoc]

### Parts
(Parts that share a designator on the sheet are numbered #1, #2 ... from top to bottom, then left to right.)
10A  Diode  (value not drawn)
10n  value 1p  (hidden comment: Capacitor)
100n  value 1p  (hidden comment: Capacitor)
100u  value 1p  (hidden comment: Capacitor)
220u  value 1p  (hidden comment: Capacitor)
C?#44  value 100u  (hidden comment: Capacitor)
C?#45  value 10 u  (hidden comment: Capacitor)
C?#46  value 10 u  (hidden comment: Capacitor)
C?#47  value 100 n  (hidden comment: Capacitor)
C?#48  value 10 u  (hidden comment: Capacitor)
L?#2  value 15u  (hidden comment: Inductor)
R?#15  value 121  (hidden comment: Resistor)
R?#16  value 365  (hidden comment: Resistor)
U?#2  LM2678S-12/NOPB  [KTW0007B_L]
U?#3  LM1084IS-3.3/NOPB  [KTT0003B_L]
U?#4  LD1117AS33TR  [SOT-223_L]

### Ports
3V3 (out, see Top_level_sch[2D], Connectors[2A], IMU[1B], MCU[2A]), 5V (out, see Top_level_sch[2D], Connectors[2A]), VBatt (in, see Top_level_sch[2D], Connectors[3A])

### Nets
3V3: C?#48.2 U?#4.2(VOUT) U?#4.4(VOUT) ; port 3V3
5V: C?#46.2 R?#15.2 U?#3.2(OUT) U?#3.4(TAB) ; port 5V
FB: 10A.1(A) 100n.1 100n.2 100u.1 220u.1 220u.2 C?#44.2 C?#45.1 C?#45.2 C?#46.1 C?#47.1 C?#47.2 C?#48.1 L?#2.2 R?#16.1 U?#2.2(VIN) U?#2.4(GND) U?#2.6(FB) U?#3.3(IN) U?#4.1(GND) U?#4.3(VIN) ; port VBatt  [also labelled GND, U5V, VBatt]
Net10A_2: 10A.2(K) 10n.2 L?#2.1 U?#2.1(VSW)
Net10n_1: 10n.1 U?#2.3(CB)
Net100u_2: 100u.2 C?#44.1
NetR?#15_1: R?#15.1 R?#16.2 U?#3.1(GND)

Not connected (* = marked no-connect by the designer): U?#2 5(NC) 7(ON/~{OFF}) 8(TAB)

### Library data of the parts
10A = Diode: AF: 1; BV: 0; BV_MAX: 1e99; EG: 1.11; FC: 0.5; IBV: 0.001; ISR: 1e-14; MJSW: 0.33; NTUN: 30; TNOM: 27; XTI: 3; SimulationGenericComponent: True; CJO: 0; CJP: 0; CTA: 0; CTP: 0; FCS: 0.5; FV_MAX: 1e99; IKF: 0; IKR: 0; JSW: 0; JTUN: 0; JTUNSW: 0; KEG: 1; KF: 0; LEVEL: 1; N: 1; NBV: 1; NR: 1; NS: 1; PHP: 1; RS: 0; TCV: 0; TLEV: 0; TLEVC: 0; TM1: 0; TM2: 0; TPB: 0; TPHP: 0; TRS: 0; TRS2: 0; TT: 0; TTT1: 0; TTT2: 0; VJ: 1; XTITUN: 3; IS: 1e-14
10n 100n 100u 220u C?#44 C?#45 C?#47 C?#48 = Capacitor: SimulationGenericComponent: True
C?#46 = Capacitor: Tantalum Capacitor; SimulationGenericComponent: True
L?#2 = Inductor: SimulationGenericComponent: True
R?#15 R?#16 = Resistor: TC1: 0; SimulationGenericComponent: True; TC2: 0
U?#2 = CMP-0069-00193-3: SIMPLE SWITCHER® High Efficiency 5A Step-Down Voltage Regulator, 7-pin TO-263, Pb-Free; Manufacturer: Texas Instruments; PackageTopMarking: NSUZXYTTE#*LM2678*S-12; PowerWise: N; ComponentLink1URL: http://www.ti.com/general/docs/lit/getliterature.tsp?genericPartNumber=LM2678&fileType=pdf; RoHS: Y; PinCount: 7; ComponentLink1Description: Datasheet URL; CompType: Switcher; PackageDescription: TO-263, Molded, .400 x .390 x .180in Body, 7 Lead, .050in Pitch, Surface Mount; Code_JEDEC: MO-169-AC; PackageReference: KTW0007B
U?#3 = CMP-0062-00591-5: 5A Low Dropout Positive Regulators, 3-pin TO-263, Pb-Free; Manufacturer: Texas Instruments; High-Reliability: Y; CompType: LDO IC; PowerWise: N; PackageTopMarking: NSUZXYTTE#*LM1084*IS-3.3; PartNumber: LM1084IS-3.3/NOPB; PinCount: 3; ComponentLink1Description: Datasheet URL; Code_JEDEC: MO-169-AA; PackageDescription: TO-263, Molded, .400 x .390 x .180in, 3 Lead, .1in Pitch, Surface Mount; PackageReference: KTT0003B; RoHS: Y; ComponentLink1URL: http://www.ti.com/general/docs/lit/getliterature.tsp?genericPartNumber=LM1084&fileType=pdf
U?#4 = CMP-0244-00316-1: 1A, Low Drop Positive Voltage Regulator, 3.3V, 4-Pin SOT-223, Tape and Reel; ComponentLink1Description: Manufacturer URL; DatasheetVersion: 2/12/2011; PackageVersion: 2010; ComponentLink1URL: http://www.st.com; ComponentLink2Description: Datasheet; ComponentLink2URL: http://www.st.com/internet/com/TECHNICAL_RESOURCES/TECHNICAL_LITERATURE/DATASHEET/CD00002116.pdf; PackageDescription: 4-Pin SOT-223 Package, 6.5 x 3.5 mm Body, 2.3 mm Pitch, 7 mm Lead Span; PackageReference: SOT-223

## Sheet QSPI Flash.SchDoc
size C; SheetNumber: 6; SheetTotal: 6
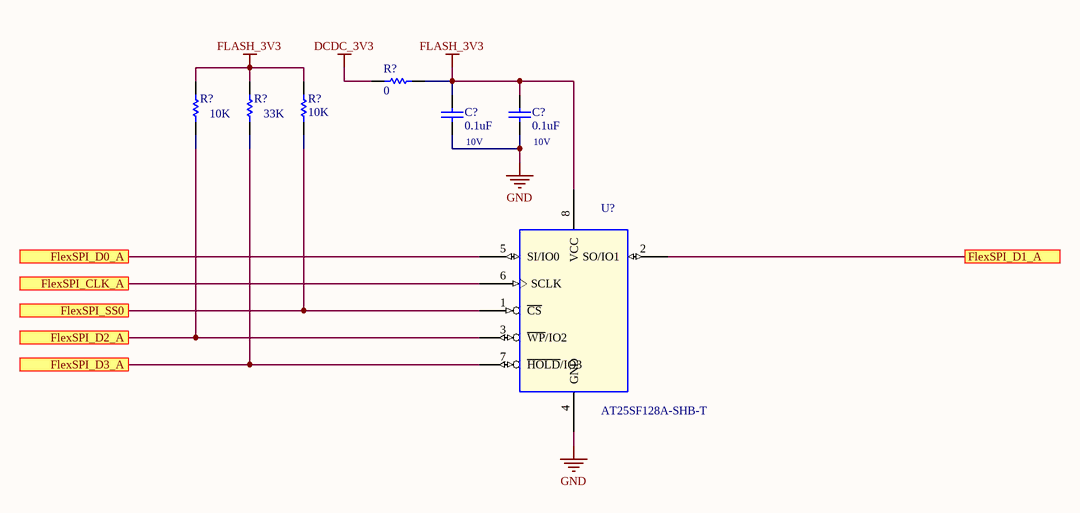
[diagram p5: QSPI Flash.SchDoc]

### Parts
(Parts that share a designator on the sheet are numbered #1, #2 ... from top to bottom, then left to right.)
C?#49  value 0.1uF  Voltage: 10V  (hidden comment: Capacitor)
C?#50  value 0.1uF  Voltage: 10V  (hidden comment: Capacitor)
R?#17  value 0  (hidden comment: Resistor)
R?#18  value 10K  (hidden comment: Resistor)
R?#19  value 33K  (hidden comment: Resistor)
R?#20  value 10K  (hidden comment: Resistor)
U?#5  AT25SF128A-SHB-T  [SO8-25X75-200]

### Ports
FlexSPI_CLK_A, FlexSPI_D0_A, FlexSPI_D1_A, FlexSPI_D2_A, FlexSPI_D3_A, FlexSPI_SS0

### Nets
DCDC_3V3: R?#17.2  [project net 3V3]
FLASH_3V3: C?#49.2 C?#50.2 R?#17.1 R?#18.2 R?#19.2 R?#20.2 U?#5.8(VCC)
GND: C?#49.1 C?#50.1 U?#5.4(GND)  [project net FB]
FlexSPI_CLK_A: U?#5.6(SCLK) ; port FlexSPI_CLK_A
FlexSPI_D0_A: U?#5.5(SI/IO0) ; port FlexSPI_D0_A
FlexSPI_D1_A: U?#5.2(SO/IO1) ; port FlexSPI_D1_A
FlexSPI_D2_A: R?#18.1 U?#5.3(~{WP}/IO2) ; port FlexSPI_D2_A
FlexSPI_D3_A: R?#19.1 U?#5.7(~{HOLD}/IO3) ; port FlexSPI_D3_A
FlexSPI_SS0: R?#20.1 U?#5.1(~{CS}) ; port FlexSPI_SS0

### Library data of the parts
C?#49 C?#50 = Capacitor: SimulationGenericComponent: True
R?#17 = Resistor: SimulationGenericComponent: True; TC1: 0; TC2: 0
R?#18-R?#20 = Resistor: TC1: 0; SimulationGenericComponent: True; TC2: 0
U?#5 = AT25SF128A: IC MEM NOR FLASH DUAL/QUAD SPI 128MBIT 133MHZ 2.7-3.6V SOP8; AGILE_PN: 342-00805; MFG_NAME01: Adesto Technologies Corporation, Inc; Temp_Range: -40¡ãC ~ 85¡ãC; CAD_APPROVED: Yes; CLASS: IC; MFG_PN01: AT25SF128A-SHB-T; ROHS: Yes; HEIGHT: 2.16MM; PCB Footprint: SO8-25X75-200

## Nets that join several sheets
3V3: MCU (7 pins), IMU (6 pins), Connectors (6 pins), Regulators (C?#48.2 U?#4.2 U?#4.4), QSPI Flash (R?#17.2)
5V: Connectors (9 pins), Regulators (C?#46.2 R?#15.2 U?#3.2 U?#3.4)
FB: MCU (53 pins), IMU (5 pins), Connectors (18 pins), Regulators (21 pins), QSPI Flash (C?#49.1 C?#50.1 U?#5.4)
ESC_PWM: MCU (IC1.5), Connectors (J?#6.1)
FlexSPI_CLK_A: MCU (IC1.65), QSPI Flash (U?#5.6)
FlexSPI_D0_A: MCU (IC1.66), QSPI Flash (U?#5.5)
FlexSPI_D1_A: MCU (IC1.68), QSPI Flash (U?#5.2)
FlexSPI_D2_A: MCU (IC1.67), QSPI Flash (R?#18.1 U?#5.3)
FlexSPI_D3_A: MCU (IC1.64), QSPI Flash (R?#19.1 U?#5.7)
FlexSPI_SS0: MCU (IC1.69), QSPI Flash (R?#20.1 U?#5.1)
GPIO_AD_2: MCU (IC1.58), Connectors (J?#5.1)
GPIO_AD_14: MCU (IC1.43), Connectors (J?#5.2)
JTAG_TCK: MCU (IC1.45), Connectors (J?#4.04)
JTAG_TDI: MCU (IC1.47), Connectors (J?#4.08)
JTAG_TDO: MCU (IC1.48), Connectors (J?#4.06)
JTAG_TMS: MCU (IC1.44), Connectors (J?#4.02 R?#13.1)
JTAG_TRSTB: MCU (IC1.49), Connectors (J?#4.10 R?#14.1)
PCS0: MCU (IC1.55), Connectors (J?#3.4)
PCS2: MCU (IC1.60), Connectors (J?#3.5)
RXD: MCU (IC1.3), Connectors (J?#3.6)
SCL: MCU (IC1.11), IMU (U?#1.8), Connectors (J?#2.1 J?#5.4)
SDA: MCU (IC1.12), IMU (U?#1.9), Connectors (J?#2.2 J?#5.3)
SDI: MCU (IC1.57), Connectors (J?#3.2)
SDK: MCU (IC1.52), Connectors (J?#3.1)
SDO: MCU (IC1.56), Connectors (J?#3.3)
Servo1_PWM: MCU (IC1.10), Connectors (J?#6.3)
Servo2_PWM: MCU (IC1.6), Connectors (J?#6.4)
Servo3_PWM: MCU (IC1.8), Connectors (J?#6.5)
Servo4_PWM: MCU (IC1.4), Connectors (J?#6.6)
TXD: MCU (IC1.2), Connectors (J?#3.7)